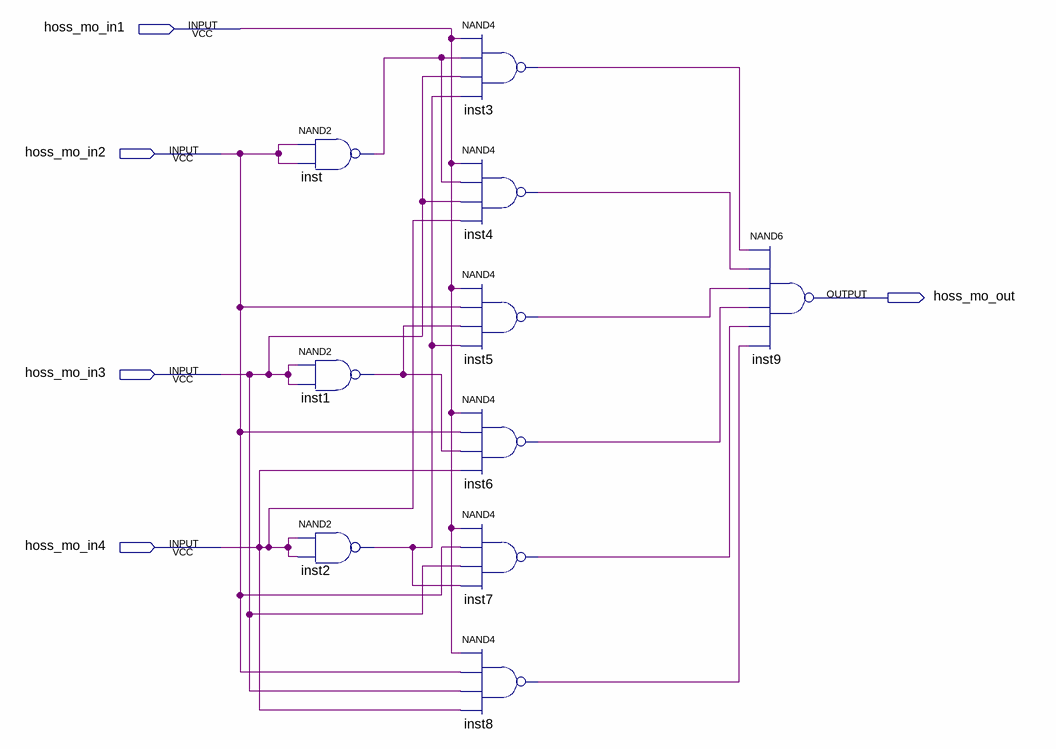
[diagram p0: schematic sheet]
// Quartus schematic comparator.bdf as structural Verilog: 10 symbols, 5 pins
module comparator (
  input  hoss_mo_in1,
  input  hoss_mo_in2,
  input  hoss_mo_in3,
  input  hoss_mo_in4,
  output hoss_mo_out
);

  wire inst1_out, inst2_out, inst3_out, inst4_out, inst5_out, inst6_out, inst7_out, inst8_out, inst_out;

  nand inst (inst_out, hoss_mo_in2, hoss_mo_in2);
  nand inst1 (inst1_out, hoss_mo_in3, hoss_mo_in3);
  nand inst2 (inst2_out, hoss_mo_in4, hoss_mo_in4);
  nand inst3 (inst3_out, hoss_mo_in1, inst_out, hoss_mo_in3, inst2_out);
  nand inst4 (inst4_out, hoss_mo_in1, inst_out, hoss_mo_in3, hoss_mo_in4);
  nand inst5 (inst5_out, hoss_mo_in1, hoss_mo_in2, inst1_out, inst2_out);
  nand inst6 (inst6_out, hoss_mo_in1, hoss_mo_in2, inst1_out, hoss_mo_in4);
  nand inst7 (inst7_out, hoss_mo_in1, hoss_mo_in2, hoss_mo_in3, inst2_out);
  nand inst8 (inst8_out, hoss_mo_in1, hoss_mo_in2, hoss_mo_in3, hoss_mo_in4);
  nand inst9 (hoss_mo_out, inst3_out, inst4_out, inst5_out, inst6_out, inst7_out, inst8_out);
endmodule
